# Altium schematic sheet Sheet1.SchDoc
size 420 x 297 mm; Address1: Address1; Address2: Address2; Address3: Address3; Address4: Address4; DocumentNumber: АБВГ.123456.001 Э3; SheetNumber: 1; Scale: 1:1; DocumentType: Схема электрическая принципиальная; FirstReferrence: АБВГ.123456.001
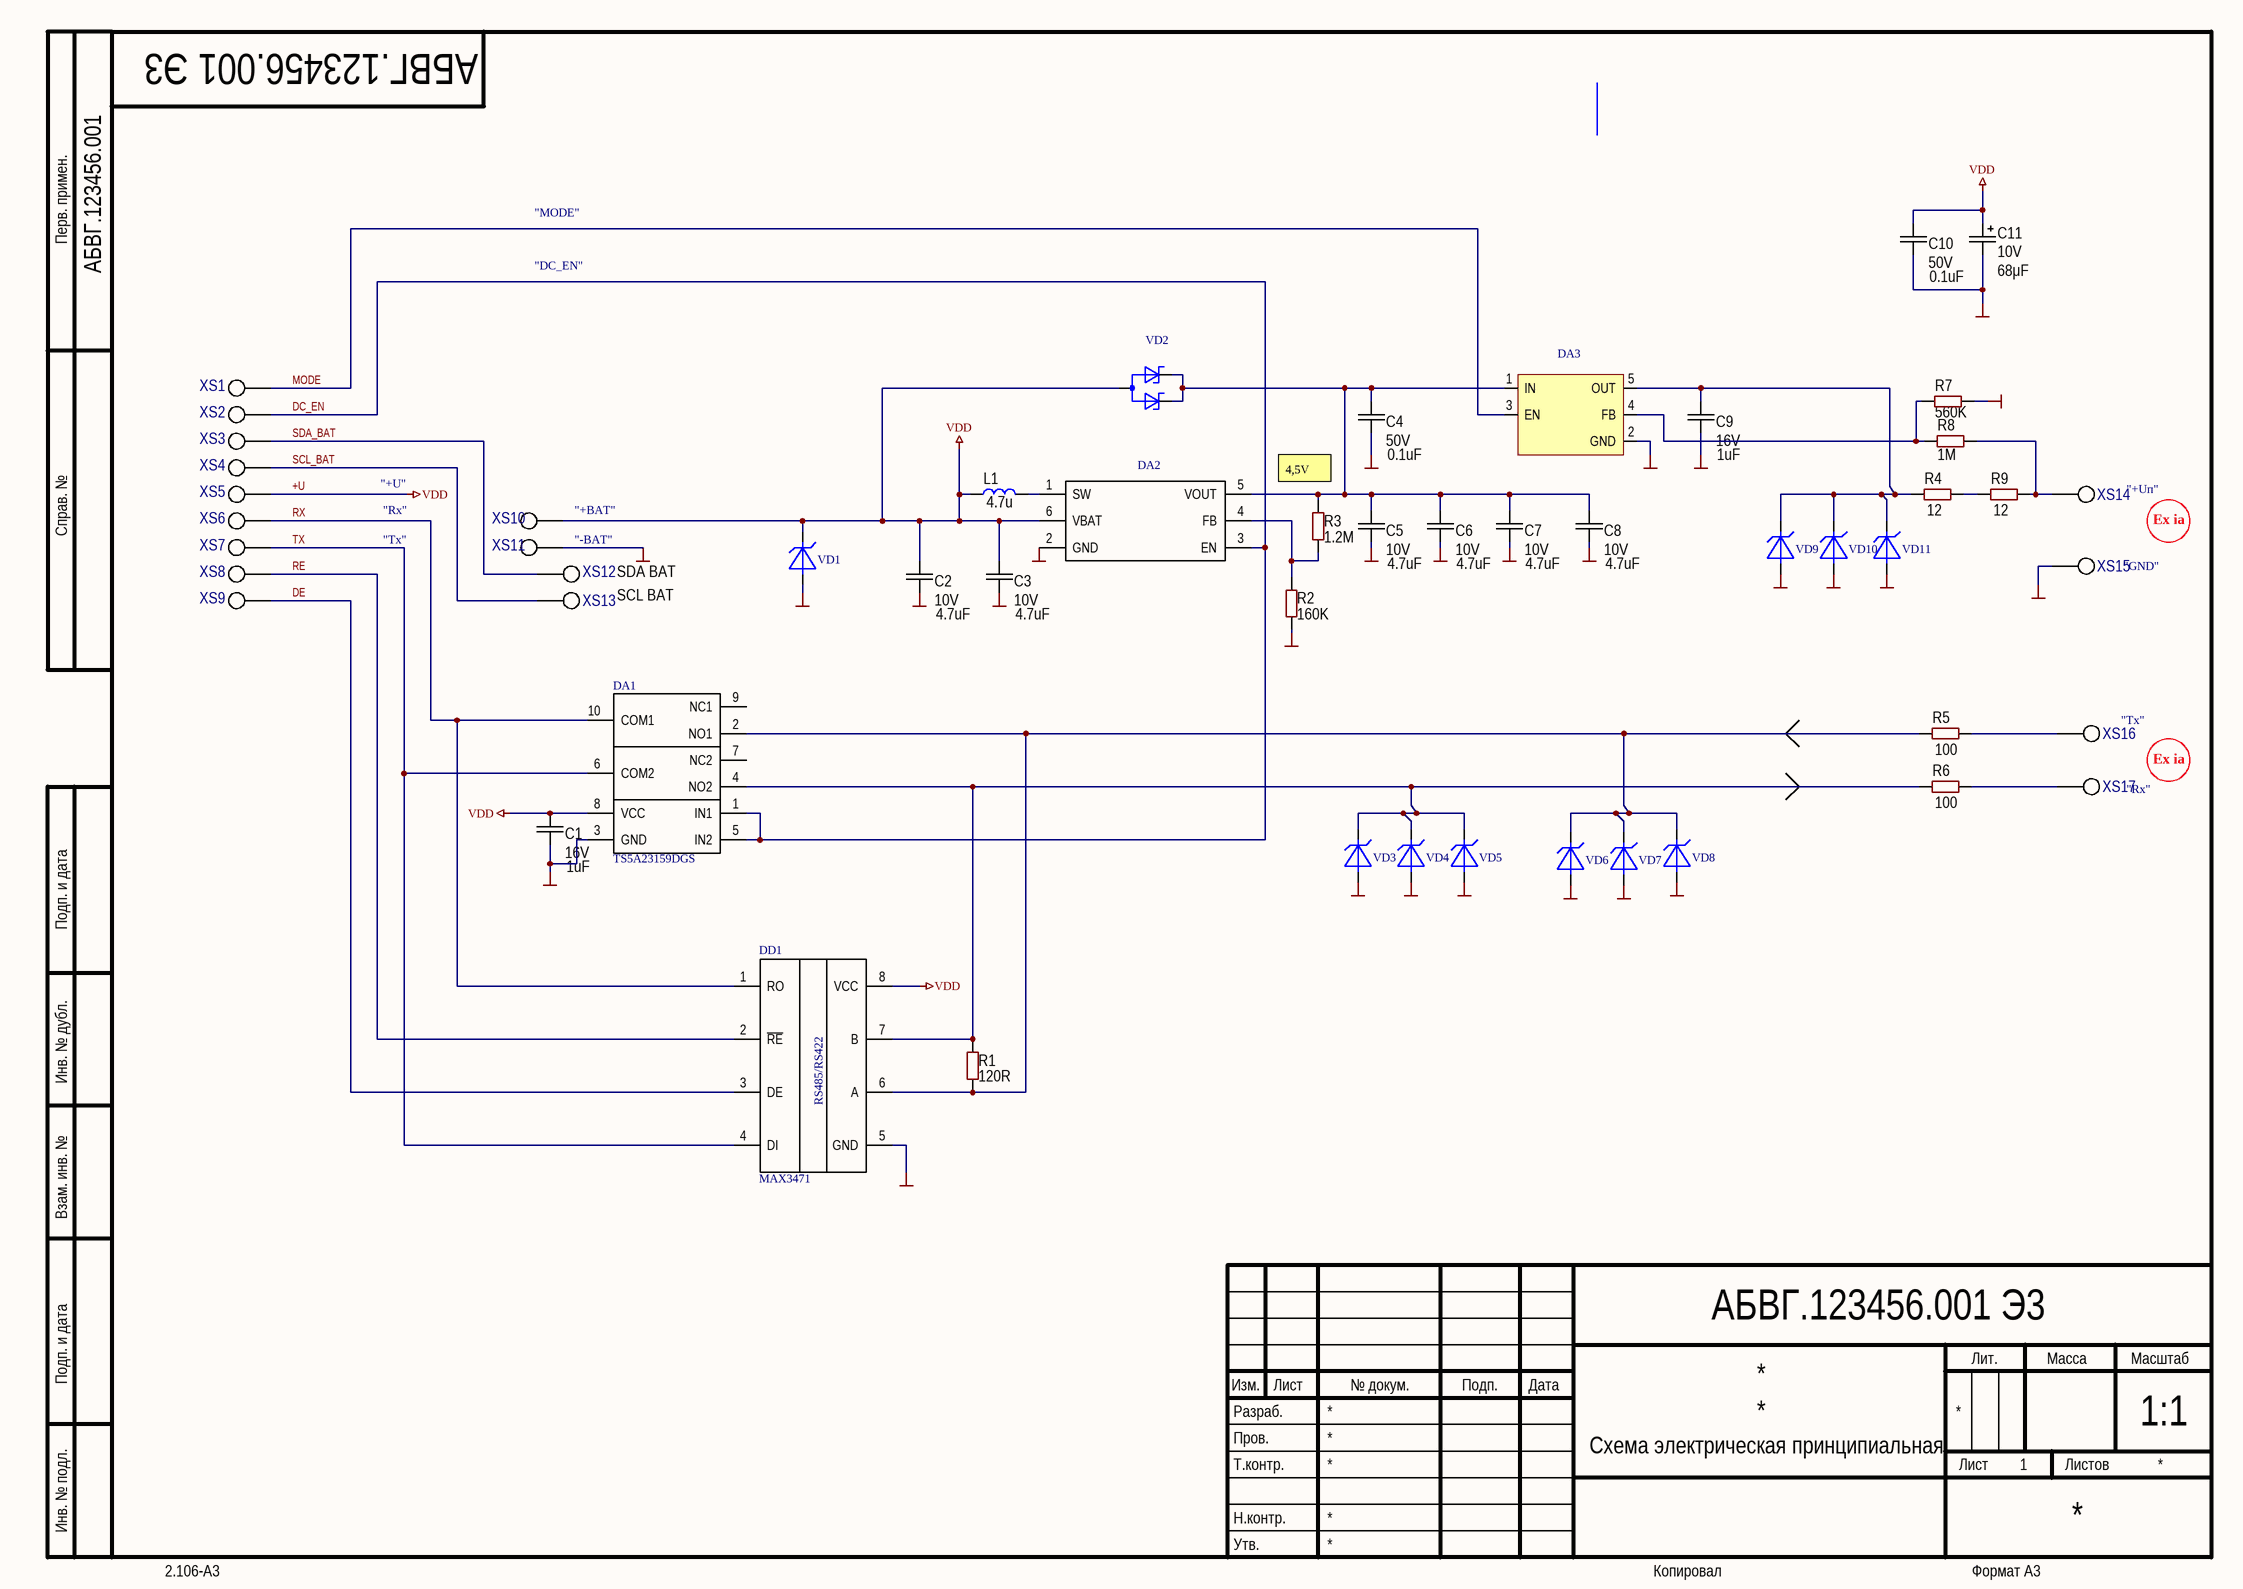
[diagram p0: Sheet1.SchDoc]

## Parts
C1  value 1uF  Voltage: 16V  [CAP: 0603]
C2  value 4.7uF  Voltage: 10V  [CAP: 0603]
C3  value 4.7uF  Voltage: 10V  [CAP: 0603]
C4  value 0.1uF  Voltage: 50V  [CAP: 0603]
C5  value 4.7uF  Voltage: 10V  [CAP: 0603]
C6  value 4.7uF  Voltage: 10V  [CAP: 0603]
C7  value 4.7uF  Voltage: 10V  [CAP: 0603]
C8  value 4.7uF  Voltage: 10V  [CAP: 0603]
C9  value 1uF  Voltage: 16V  [CAP: 0603]
C10  value 0.1uF  Voltage: 50V  [CAP: 0603]
C11  value 68μF  Voltage: 10V  [CAP: TANTAL-B]
DA1  TS5A23159DGS  [VSSSOP-10 - TI]
DA2  TPS6107x  [SOT23-6]  (value not drawn)
DA3  TPS78001DDC  [SOT23-5]  (value not drawn)
DD1  MAX3471  [MSOP-8]
L1  value 4.7u  [IND: CDRH4D28NP]  (hidden comment: CDRH4D)
R1  value 120R  [RES: 0603]
R2  value 160K  [RES: 0603]
R3  value 1.2M  [RES: 0603]
R4  value 12  [RES: 2512]
R5  value 100  [RES: 2512]
R6  value 100  [RES: 2512]
R7  value 560K  [RES: 0603]
R8  value 1M  [RES: 0603]
R9  value 12  [RES: 2512]
VD1  SM2T  [DO216-AA]  (value not drawn)
VD2  BAT54AW  [SC-70]  (value not drawn)
VD3  SM2T  [DO216-AA]  (value not drawn)
VD4  SM2T  [DO216-AA]  (value not drawn)
VD5  SM2T  [DO216-AA]  (value not drawn)
VD6  SM2T  [DO216-AA]  (value not drawn)
VD7  SM2T  [DO216-AA]  (value not drawn)
VD8  SM2T  [DO216-AA]  (value not drawn)
VD9  SM2T  [DO216-AA]  (value not drawn)
VD10  SM2T  [DO216-AA]  (value not drawn)
VD11  SM2T  [DO216-AA]  (value not drawn)
XS1  Testpoint_HS1mm  [TestPoint(without 3D)]  (value not drawn)
XS2  Testpoint_HS1mm  [TestPoint(without 3D)]  (value not drawn)
XS3  Testpoint_HS1mm  [TestPoint(without 3D)]  (value not drawn)
XS4  Testpoint_HS1mm  [TestPoint(without 3D)]  (value not drawn)
XS5  Testpoint_HS1mm  [TestPoint(without 3D)]  (value not drawn)
XS6  Testpoint_HS1mm  [TestPoint(without 3D)]  (value not drawn)
XS7  Testpoint_HS1mm  [TestPoint(without 3D)]  (value not drawn)
XS8  Testpoint_HS1mm  [TestPoint(without 3D)]  (value not drawn)
XS9  Testpoint_HS1mm  [TestPoint(without 3D)]  (value not drawn)
XS10  Testpoint_HS1mm  [TestPoint(without 3D)]  (value not drawn)
XS11  Testpoint_HS1mm  [TestPoint(without 3D)]  (value not drawn)
XS12  Testpoint_HS1mm  [TestPoint(without 3D)]  (value not drawn)
XS13  Testpoint_HS1mm  [TestPoint(without 3D)]  (value not drawn)
XS14  Testpoint_HS1mm  [TestPoint(without 3D)]  (value not drawn)
XS15  Testpoint_HS1mm  [TestPoint(without 3D)]  (value not drawn)
XS16  Testpoint_HS1mm  [TestPoint(without 3D)]  (value not drawn)
XS17  Testpoint_HS1mm  [TestPoint(without 3D)]  (value not drawn)

## Nets
+U: C1.2 C2.2 C3.2 C10.2 C11.1 DA1.8(VCC) DA2.6(VBAT) DD1.8(VCC) L1.1 VD1.1(C) VD2.3(OA) XS5.1 XS10.1  [also labelled VDD]
GND: C1.1 C2.1 C3.1 C4.1 C5.1 C6.1 C7.1 C8.1 C9.1 C10.1 C11.2 DA1.3(GND) DA2.2(GND) DA3.2(GND) DD1.5(GND) R2.1 R7.1 VD1.2(A) VD3.2(A) VD4.2(A) VD5.2(A) VD6.2(A) VD7.2(A) VD8.2(A) VD9.2(A) VD10.2(A) VD11.2(A) XS11.1 XS15.1
DC_EN: DA1.1(IN1) DA1.5(IN2) DA2.3(EN) XS2.1
DE: DD1.3(DE) XS9.1
MODE: DA3.3(EN) XS1.1
RE: DD1.2(~{RE}) XS8.1
RX: DA1.10(COM1) DD1.1(RO) XS6.1
SCL_BAT: XS4.1 XS13.1
SDA_BAT: XS3.1 XS12.1
TX: DA1.6(COM2) DD1.4(DI) XS7.1
NetC4_2: C4.2 C5.2 C6.2 C7.2 C8.2 DA2.5(VOUT) DA3.1(IN) R3.2 VD2.1(C) VD2.2(C)
NetC9_2: C9.2 DA3.5(OUT) R4.1 VD9.1(C) VD10.1(C) VD11.1(C)
NetDA1_2: DA1.2(NO1) DD1.6(A) R1.1 R5.1 VD6.1(C) VD7.1(C) VD8.1(C)
NetDA1_4: DA1.4(NO2) DD1.7(B) R1.2 R6.1 VD3.1(C) VD4.1(C) VD5.1(C)
NetDA2_1: DA2.1(SW) L1.2
NetDA2_4: DA2.4(FB) R2.2 R3.1
NetDA3_4: DA3.4(FB) R7.2 R8.2
NetR4_2: R4.2 R9.1
NetR5_2: R5.2 XS16.1
NetR6_2: R6.2 XS17.1
NetR8_1: R8.1 R9.2 XS14.1

Not connected (* = marked no-connect by the designer): DA1 7(NC2) 9(NC1)

## Notes on the sheet
- "MODE"
- "DC_EN"
- "+U"
- "Rx"
- "+BAT"
- (near R3) 4,5V
- (near XS14) "+Uп"
- Ex ia
- "Tx"
- "-BAT"
- SDA BAT
- (near XS15) "GND"
- SCL BAT
- (near XS16) "Tx"
- Перв. примен.
- Справ. №
- Подп. и дата
- Инв. № дубл.
- Взам. инв. №
- Разраб.
- Изм.
- Лист
- № докум.
- Подп.
- Дата
- Лит.
- Масса
- Масштаб
- Пров.
- Т.контр.
- Листов
- Инв. № подл.
- Утв.
- Н.контр.
- 2.106-A3
- Копировал
- Формат А3
- (in symbol MAX3471) RS485/RS422

## Library data of the parts
C1 C9 = Ceramic_0603: Manufacturer: Yageo; PartNumber: CC0603KRX7R7BB104; ValueManufacturerPartNumber: Ceramic capacitor, 1uF, X7R, ±10%, 16V, 0603, -55...+125°C; TypeCapacitor: Ceramic capacitor; Tolerance: ±10%; TypeDielectric: X7R; Package: 0603; HelpURL: https://www.digikey.com/product-detail/en/yageo/CC0603KRX7R7BB104/311-1088-1-ND/302998; Temperature: -55...+125°C
C2 C3 C5-C8 = Ceramic_0603: Manufacturer: Yageo; PartNumber: CC0603KRX7R7BB104; ValueManufacturerPartNumber: Ceramic capacitor, 4.7uF, X7R, ±10%, 10V, 0603, -55...+125°C; TypeCapacitor: Ceramic capacitor; Tolerance: ±10%; TypeDielectric: X7R; Package: 0603; HelpURL: https://www.digikey.com/product-detail/en/yageo/CC0603KRX7R7BB104/311-1088-1-ND/302998; Temperature: -55...+125°C
C4 C10 = Ceramic_0603: Manufacturer: Yageo; PartNumber: CC0603KRX7R7BB104; ValueManufacturerPartNumber: Ceramic capacitor, 0.1uF, X7R, ±10%, 50V, 0603, -55...+125°C; TypeCapacitor: Ceramic capacitor; Tolerance: ±10%; TypeDielectric: X7R; Package: 0603; HelpURL: https://www.digikey.com/product-detail/en/yageo/CC0603KRX7R7BB104/311-1088-1-ND/302998; Temperature: -55...+125°C
C11 = Tantal_B: Manufacturer: AVX; PartNumber: F930J227KBA; ValueManufacturerPartNumber: Tantalum capacitor, 68μF, 10V, ±10%, 1.2Ohm, case B (3528), -55...+125°C; Impedance: 1.2Ohm; Tolerance: ±10%; TypeDielectric: X7R; TypeCapacitor: Tantalum capacitor; Package: case B (3528); HelpURL: https://www.digikey.com/product-detail/en/avx-corporation/F930J227KBA/478-8166-1-ND/4005570; Temperature: -55...+125°C
DA1 = TS5A23159DGS: Микросхема; Manufacturer: Texas Instruments; PartNumber: TS5A23159DGS
DA2 = TPS61070: Микросхема; Manufacturer: Texas Instruments; ComponentLink1Description: Data Sheet; ComponentLink3URL: *; ReplacementPart1Manufacturer: *; ReplacementPart1PartNumber: *; ReplacementPart1TopMarking: *; ReplacementPart2Manufacturer: *; ReplacementPart2PartNumber: *; ReplacementPart2TopMarking: *; TopMarking: *; PartNumber: TPS6107x
DA3 = TPS78001DDC: Микросхема; Manufacturer: Texas Instruments; Part Number: TPS780270200DDCT; ComponentLink1Description: Data Sheet; ComponentLink1URL: http://focus.ti.com/lit/ds/symlink/tps780270200.pdf
DD1 = MAX3471: RS-485/RS422Half-Duplex,  Differential Transceiver for Battery-Powered Systems; Manufacturer: MAXIM; ComponentLink1Description: Data Sheet; ComponentLink1URL: \\Mskd20virt\KB\PDF\Интерфейсы\RS232_485\MAX3471.pdf; ComponentLink2Description: Replacement 1 Data Sheet; PartNumber: MAX3471
L1 = CDRH4D28NP: ComponentLink1Description: Datasheet; ComponentLink1URL: https://products.sumida.com/products/pdf/CDRH4D28.pdf
R1 = Resistor_0603: Manufacturer: Yageo; PartNumber: RC0603JR-07100RL; ValueManufacturerPartNumber: Resistor film, 120R, ±5%, 0603, 0.1W, -55...+125°C; TypeResistor: Resistor film; Power: 0.1W; Tolerance: ±5%; Package: 0603; HelpURL: https://www.digikey.com/product-detail/en/yageo/RC0603JR-07100RL/311-100GRCT-ND/729644; Temperature: -55...+125°C
R2 = Resistor_0603: Manufacturer: Yageo; PartNumber: RC0603JR-07100RL; ValueManufacturerPartNumber: Resistor film, 160K, ±5%, 0603, 0.1W, -55...+125°C; TypeResistor: Resistor film; Power: 0.1W; Tolerance: ±5%; Package: 0603; HelpURL: https://www.digikey.com/product-detail/en/yageo/RC0603JR-07100RL/311-100GRCT-ND/729644; Temperature: -55...+125°C
R3 = Resistor_0603: Manufacturer: Yageo; PartNumber: RC0603JR-07100RL; ValueManufacturerPartNumber: Resistor film, 1.2M, ±5%, 0603, 0.1W, -55...+125°C; TypeResistor: Resistor film; Power: 0.1W; Tolerance: ±5%; Package: 0603; HelpURL: https://www.digikey.com/product-detail/en/yageo/RC0603JR-07100RL/311-100GRCT-ND/729644; Temperature: -55...+125°C
R4 R9 = Resistor_2512: Manufacturer: Yageo; PartNumber: RC2512JK-07100RL; ValueManufacturerPartNumber: Resistor film, 12, ±5%, 2512, 1W, -55...+125°C; TypeResistor: Resistor film; Power: 1W; Tolerance: ±5%; Package: 2512; HelpURL: https://www.digikey.com/product-detail/en/yageo/RC2512JK-07100RL/YAG3393CT-ND/5962215; Temperature: -55...+125°C
R5 R6 = Resistor_2512: Manufacturer: Yageo; PartNumber: RC2512JK-07100RL; ValueManufacturerPartNumber: Resistor film, 100, ±5%, 2512, 1W, -55...+125°C; TypeResistor: Resistor film; Power: 1W; Tolerance: ±5%; Package: 2512; HelpURL: https://www.digikey.com/product-detail/en/yageo/RC2512JK-07100RL/YAG3393CT-ND/5962215; Temperature: -55...+125°C
R7 = Resistor_0603: Manufacturer: Yageo; PartNumber: RC0603JR-07100RL; ValueManufacturerPartNumber: Resistor film, 560K, ±5%, 0603, 0.1W, -55...+125°C; TypeResistor: Resistor film; Power: 0.1W; Tolerance: ±5%; Package: 0603; HelpURL: https://www.digikey.com/product-detail/en/yageo/RC0603JR-07100RL/311-100GRCT-ND/729644; Temperature: -55...+125°C
R8 = Resistor_0603: Manufacturer: Yageo; PartNumber: RC0603JR-07100RL; ValueManufacturerPartNumber: Resistor film, 1M, ±5%, 0603, 0.1W, -55...+125°C; TypeResistor: Resistor film; Power: 0.1W; Tolerance: ±5%; Package: 0603; HelpURL: https://www.digikey.com/product-detail/en/yageo/RC0603JR-07100RL/311-100GRCT-ND/729644; Temperature: -55...+125°C
VD1 VD3-VD11 = SM2T: TVS Диод; Manufacturer: ST Microelectronics; ComponentLink1Descriprion: Data Sheet; ComponentLink1URL: *; ComponentLink2Description: Replacement 1 Data Sheet; ComponentLink2URL: *; ComponentLink3Description: Replacement 2 Data Sheet; ComponentLink3URL: *; PartNumber: *; ReplacementPart1Manufacturer: *; ReplacementPart1PartNumber: *; ReplacementPart1TopMarking: *; ReplacementPart2Manufacturer: *; ReplacementPart2TopMarking: *; TopMarking: *; ReplacementPart2PartNumber: *; StandOffVoltage: *
VD2 = BAT54AW: Сборка диодная; Manufacturer: NXP; ReplacementPart2TopMarking: TA; ReplacementPart1Manufacturer: ON Semiconductor; ReplacementPart1PartNumber: BAT54AWT1G; ReplacementPart1TopMarking: B7*; ReplacementPart2Manufacturer: Infineon; ReplacementPart2PartNumber: BAT54-06W; TopMarking: 42; Type: *; Power/Voltage: *; PartNumber: BAT54AW; Package: SC-70; ComponentLink1Description: DataSheet; ComponentLink1URL: http://www.nxp.com/documents/data_sheet/BAT54W.pdf; ComponentLink2URL: http://www.onsemi.com/pub_link/Collateral/BAT54AWT1-D.PDF; ComponentLink3Description: Replacement2DataSheet; ComponentLink3URL: http://www.infineon.com/dgdl/bat54series.pdf?folderId=db3a30431400ef68011425f1ca2505e3&fileId=db3a304314dca3890115190b74210ea6; ComponentLink2Description: Replacement1DataSheet